# EAGLE design so20 (EAGLE 5.11)
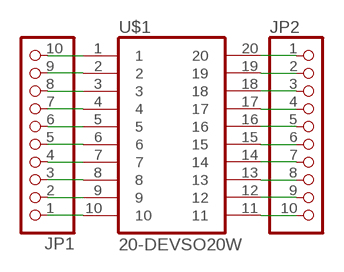
[diagram p0: schematic, sheet 1]

## Parts
JP1  PINHD-1X10  [1X10]
JP2  PINHD-1X10  [1X10]
U$1  20-DEVSO20W  [SO20W]

## Nets
N$1: JP1.10 U$1.1
N$2: JP1.9 U$1.2
N$3: JP1.8 U$1.3
N$4: JP1.7 U$1.4
N$5: JP1.6 U$1.5
N$6: JP1.5 U$1.6
N$7: JP1.4 U$1.7
N$8: JP1.3 U$1.8
N$9: JP1.2 U$1.9
N$10: JP1.1 U$1.10
N$11: JP2.10 U$1.11
N$12: JP2.9 U$1.12
N$13: JP2.8 U$1.13
N$14: JP2.7 U$1.14
N$15: JP2.6 U$1.15
N$16: JP2.5 U$1.16
N$17: JP2.4 U$1.17
N$18: JP2.3 U$1.18
N$19: JP2.2 U$1.19
N$20: JP2.1 U$1.20

## Library data of the parts
JP1 JP2 = pinhead:PINHD-1X10: PIN HEADER
U$1 = packages:20-DEV

## Board
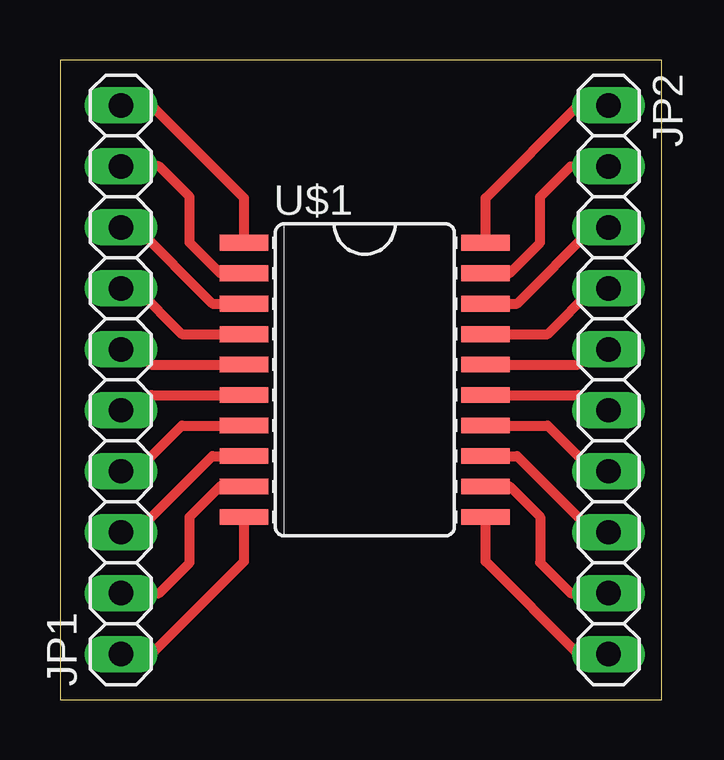
[diagram p1: board, top side]

Size 25.07 x 26.66 mm. Coordinates in mm from the lower left corner, seen from the top.
Outline: 0,0 25.07,0 25.07,26.66 0,26.66 0,0
Copper layers (1*16): Top 0.035mm / dielectric 1.5mm / Bottom 0.035mm
Design rules "default": minimum track width 10mil, minimum drill 24mil, track to track 8mil, track to pad 8mil, pad to pad 8mil, via to via 8mil, smd to smd 8mil, copper to edge 40mil, drill to drill 8mil, minimum pad ring 10mil, minimum via ring 8mil, stop-mask expansion 4mil, vias tented up to drill 0mil, thermal gap 10mil

### Footprints (pad centres in the part's own frame; a part is rotated, then mirrored left to right if it is on the bottom)
1X10 = drill 1.016 long: 1 -11.43,0; 2 -8.89,0; 3 -6.35,0; 4 -3.81,0; 5 -1.27,0; 6 1.27,0; 7 3.81,0; 8 6.35,0; 9 8.89,0; 10 11.43,0
SO20W = smd 0.66 x 2.032: 1 -5.715,-5.029; 2 -4.445,-5.029; 3 -3.175,-5.029; 4 -1.905,-5.029; 5 -0.635,-5.029; 6 0.635,-5.029; 7 1.905,-5.029; 8 3.175,-5.029; 9 4.445,-5.029; 10 5.715,-5.029; 11 5.715,5.029; 12 4.445,5.029; 13 3.175,5.029; 14 1.905,5.029; 15 0.635,5.029; 16 -0.635,5.029; 17 -1.905,5.029; 18 -3.175,5.029; 19 -4.445,5.029; 20 -5.715,5.029

### Placement (x,y rotation side)
JP1  2.54,13.34 90 top
JP2  22.86,13.34 270 top
U$1  12.7,13.34 270 top

### Tracks (layer width: path | path; a pad name or v marks a point on that pad's centre or on a via)
N$1
  Top 0.406: U$1.1 7.67,20.9 3.81,24.77 JP1.10
N$2
  Top 0.406: U$1.2 6.67,17.78 5.4,19.05 5.4,20.95 4.13,22.23 JP1.9
N$3
  Top 0.406: U$1.3 6.35,16.51 3.17,19.68 JP1.8
N$4
  Top 0.406: U$1.4 5.08,15.24 3.17,17.14 JP1.7
N$5
  Top 0.406: U$1.5 3.81,13.97 3.17,14.61 JP1.6
N$6
  Top 0.406: U$1.6 3.81,12.7 3.17,12.06 JP1.5
N$7
  Top 0.406: U$1.7 5.08,11.43 3.17,9.53 JP1.4
N$8
  Top 0.406: U$1.8 6.35,10.16 3.17,6.99 JP1.3
N$9
  Top 0.406: U$1.9 6.67,8.89 5.4,7.62 5.4,5.71 4.13,4.45 JP1.2
N$10
  Top 0.406: U$1.10 7.67,5.77 3.81,1.91 JP1.1
N$11
  Top 0.406: U$1.11 17.73,5.77 21.59,1.91 JP2.10
N$12
  Top 0.406: U$1.12 18.73,8.89 20,7.62 20,5.71 21.27,4.45 JP2.9
N$13
  Top 0.406: U$1.13 19.05,10.16 22.23,6.99 JP2.8
N$14
  Top 0.406: U$1.14 20.32,11.43 22.23,9.53 JP2.7
N$15
  Top 0.406: U$1.15 21.59,12.7 22.23,12.06 JP2.6
N$16
  Top 0.406: U$1.16 21.59,13.97 22.23,14.61 JP2.5
N$17
  Top 0.406: U$1.17 20.32,15.24 22.23,17.14 JP2.4
N$18
  Top 0.406: U$1.18 19.05,16.51 22.23,19.68 JP2.3
N$19
  Top 0.406: U$1.19 18.73,17.78 20,19.05 20,20.95 21.27,22.23 JP2.2
N$20
  Top 0.406: U$1.20 17.73,20.9 21.59,24.77 JP2.1

### Text on the board
tDocu: 1 | 20 | SO20 | 10 | 11